# EAGLE design imu_spi (EAGLE 9.6.2)
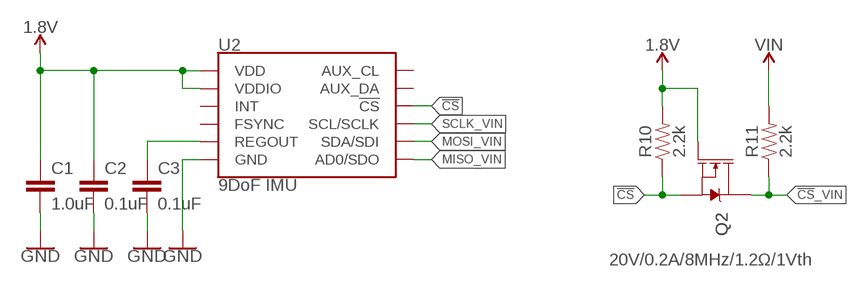
[diagram p0: schematic, sheet 1]

## Parts
C1  1.0uF  1.0UF-0603-16V-10%-X7R  [0603]
C2  0.1uF  0.1UF-0603-25V-5%  [0603]
C3  0.1uF  0.1UF-0603-25V-5%  [0603]
Q2  20V/0.2A/8MHz/1.2Ω/1Vth  MOSFET-NCH-RE1C002UN  [SOT-416FL]
R10  2.2k  2.2KOHM-0402T-1/16W-1%  [0402-TIGHT]
R11  2.2k  2.2KOHM-0402T-1/16W-1%  [0402-TIGHT]
U2  9DoF IMU  ICM-20948  [QFN24-3X3]

## Nets
1.8V: C1.1 C2.1 Q2.1(G) R10.2 U2.8(VDDIO) U2.13(VDD)
!CS: Q2.2(S) R10.1 U2.22(!CS)
!CS!_VIN: Q2.3(D) R11.1
GND: C1.2 C2.2 C3.2 U2.18(GND) U2.20(GND)
MISO_VIN: U2.9(AD0/SDO)
MOSI_VIN: U2.24(SDA/SDI)
N$1: C3.1 U2.10(REGOUT)
SCLK_VIN: U2.23(SCL/SCLK)
VIN: R11.2
Unconnected: U2.7(AUX_CL) U2.11(FSYNC) U2.12(INT) U2.21(AUX_DA)

## Library data of the parts
C1 = SparkFun-Capacitors:1.0UF: 1µF ceramic capacitors A capacitor is a passive two-terminal electrical component used to store electrical energy temporarily in an electric field.; PROD_ID: CAP-13930
C2 C3 = SparkFun-Capacitors:0.1UF: 0.1µF ceramic capacitors A capacitor is a passive two-terminal electrical component used to store electrical energy temporarily in an electric field.; PROD_ID: CAP-08604
Q2 = SparkFun-DiscreteSemi:MOSFET-NCH: N-channel MOSFETs Voltage controlled devices that allow control of high current outputs. SparkFun Products: SparkFun OpenScale <https://www.sparkfun.com/products/13261> SparkFun Digital Sandbox <https://www.sparkfun.com/products/12651> SparkFun Monster Moto Shield <https://www.sparkfun.com/products/10182> SparkFun MOSFET Power Controller <https://www.sparkfun.com/products/11214>; PROD_ID: TRANS_14399
R10 R11 = SparkFun-Resistors:2.2KOHM: 2.2kΩ resistor A resistor is a passive two-terminal electrical component that implements electrical resistance as a circuit element. Resistors act to reduce current flow, and, at the same time, act to lower voltage levels within circuits. - Wikipedia; PROD_ID: RES-14341
U2 = SparkFun-Sensors:ICM-20948: ICM-20948 9 Degree of Freedom IMU World’s lowest power 9-axis MotionTracking device that is ideally suited for smartphones, tablets, wearable sensors, and IoT applications. Includes onboard Digital Motion Processor to offload computations from the host processor Datasheet <https://cdn.sparkfun.com/assets/learn_tutorials/5/5/0/MPU9250REV1.0.pdf> SparkFun Products: SparkFun IMU Breakout - ICM-20948 <https://www.sparkfun.com/products/15182>; PROD_ID: IC-14247

## Board
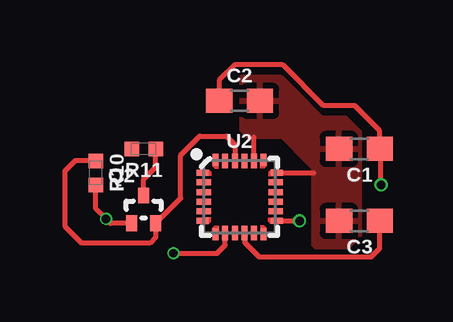
[diagram p1: board, top side]
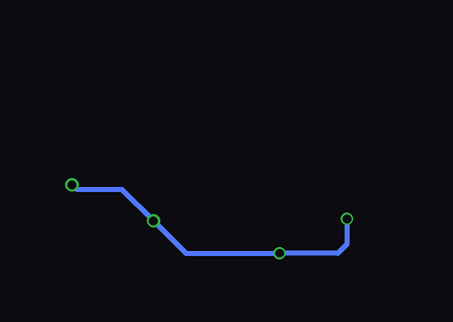
[diagram p2: board, bottom side, seen from below]

No outline drawn. Coordinates in mm, seen from the top.
Copper layers (1*16): Top 0.035mm / dielectric 1.6mm / Bottom 0.035mm
Design rules "jlcpcb-2layers": minimum track width 5mil, minimum drill 0.3mm, track to track 5mil, track to pad 5mil, pad to pad 5mil, via to via 5mil, smd to smd 5mil, copper to edge 0.2mm, drill to drill 6mil, minimum pad ring 10mil, minimum via ring 3mil, stop-mask expansion 4mil, vias tented up to drill 0mil, thermal gap 10mil

### Footprints (pad centres in the part's own frame; a part is rotated, then mirrored left to right if it is on the bottom)
0603 = smd 1.1 x 1: 1 -0.85,0; 2 0.85,0
SOT-416FL = smd 0.46 x 0.65: 1 -0.5,-1.1; 2 0.5,-1.1; 3 0,0.05
0402-TIGHT = smd 0.6 x 0.6: 1 -0.5,0; 2 0.5,0
QFN24-3X3 = smd 0.495 x 0.25: 1 -1.552,1; 6 -1.552,-1; 13 1.552,-1; 18 1.552,1 | smd 0.6 x 0.25: 2 -1.5,0.6; 3 -1.5,0.2; 4 -1.5,-0.2; 5 -1.5,-0.6; 14 1.5,-0.6; 15 1.5,-0.2; 16 1.5,0.2; 17 1.5,0.6 | smd 0.25 x 0.495: 7 -1,-1.552; 12 1,-1.552; 19 1,1.552; 24 -1,1.552 | smd 0.25 x 0.6: 8 -0.6,-1.5; 9 -0.2,-1.5; 10 0.2,-1.5; 11 0.6,-1.5; 20 0.6,1.5; 21 0.2,1.5; 22 -0.2,1.5; 23 -0.6,1.5

### Placement (x,y rotation side)
C1  10,5 180 top
C2  5,7 0 top
C3  10,2 180 top
Q2  1,3 0 top
R10  -1,4 270 top
R11  1,5 180 top
U2  5,3 0 top

### Tracks (layer width: path | path; a pad name or v marks a point on that pad's centre or on a via)
1.8V  (via drill 0.35, 0.35 pad 0.55)
  Top 0.203: Q2.1 -0.39,1.9 v-0.57,2.08 -1,2.51 R10.2 | v2.24,0.65 4.06,0.65 4.4,0.99 U2.8 | U2.13 v7.5,2 | v10.9,3.5 10.9,4.95 C1.1 10.85,5.75 9.8,6.8 8.5,6.8 6.8,8.5 4.8,8.5 4.15,7.85 C2.1
  Bottom 0.203: v-0.57,2.08 -0.57,1.03 -0.19,0.65 v2.24,0.65 6.15,0.65 v7.5,2 8.8,3.3 10.7,3.3 v10.9,3.5
!CS
  Top 0.203: R10.1 -1.86,4.5 -2.29,4.07 -2.29,1.78 -1.58,1.07 1.26,1.07 1.5,1.31 Q2.2 2.54,2.94 2.54,4.73 3.34,5.53 4.46,5.53 4.81,5.18 U2.22
!CS!_VIN
  Top 0.203: Q2.3 1,3.74 1.5,4.24 R11.1
GND
  Top 0.203: U2.20 5.6,5.5 | U2.18 8.1,4
  pour Top: 5.1,8 6.7,8 7.3,7.4 8.4,6.3 9.4,6.3 10,5.7 10,4.1 10,1.4 9.5,0.9 8.2,0.9 8.1,1 8.1,4.2 7.9,4.4 6.8,5.5 5.4,5.5 5.1,5.8
N$1
  Top 0.203: U2.10 5.22,1.48 5.22,1.09 5.82,0.5 10.5,0.5 10.85,0.85 C3.1